# EAGLE design BoB Brain v05 (EAGLE 7.5.0)

## Sheet 1 of 2: LED Controller
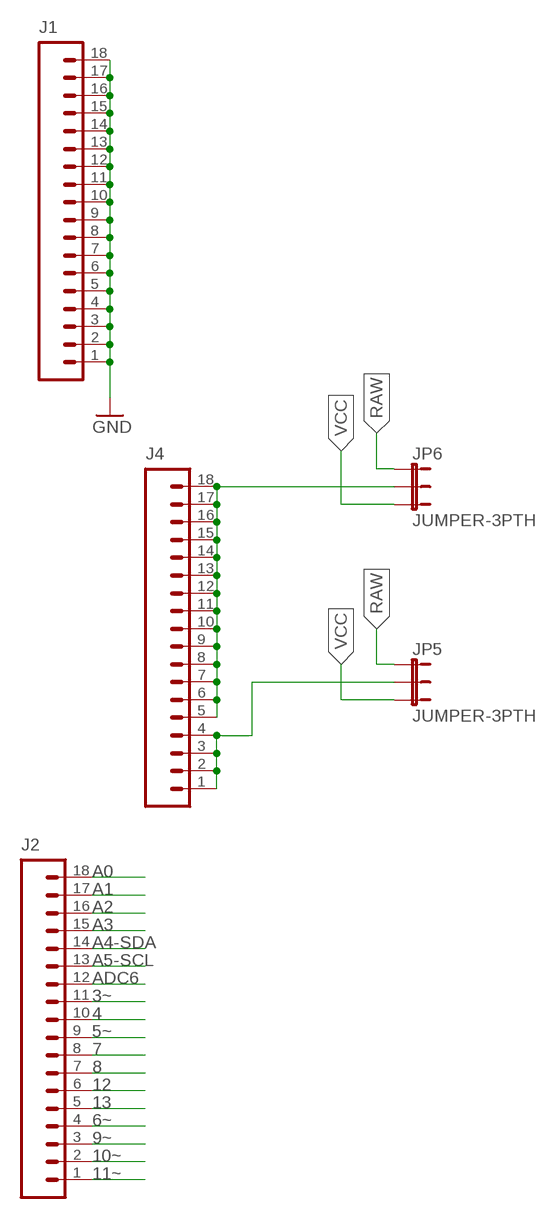
[diagram p0: schematic, sheet 1]

### Parts
J1  M18_  [1X18]
J2  M18_  [1X18]
J4  M18_  [1X18]
JP5  JUMPER-3PTH  [1X03]
JP6  JUMPER-3PTH  [1X03]

### Nets
3~: J2.18 ; also sheet 2
4: J2.17 ; also sheet 2
5~: J2.9 ; also sheet 2
6V: J4.5 J4.6 J4.7 J4.8 J4.9 J4.10 J4.11 J4.12 J4.13 J4.14 J4.15 J4.16 J4.17 J4.18 JP6.2
6~: J2.4 ; also sheet 2
7: J2.8 ; also sheet 2
8: J2.7 ; also sheet 2
9~: J2.3 ; also sheet 2
10~: J2.2 ; also sheet 2
11~: J2.1 ; also sheet 2
12: J2.6 ; also sheet 2
13: J2.5 ; also sheet 2
A0: J2.12 ; also sheet 2
A1: J2.10 ; also sheet 2
A2: J2.16 ; also sheet 2
A3: J2.13 ; also sheet 2
A4-SDA: J2.14 ; also sheet 2
A5-SCL: J2.15 ; also sheet 2
ADC6: J2.11 ; also sheet 2
GND: J1.1 J1.2 J1.3 J1.4 J1.5 J1.6 J1.7 J1.8 J1.9 J1.10 J1.11 J1.12 J1.13 J1.14 J1.15 J1.16 J1.17 J1.18 ; also sheet 2
PIN_PWR: J4.1 J4.2 J4.3 J4.4 JP5.2
RAW: JP5.1 JP6.1 ; also sheet 2
VCC: JP5.3 JP6.3 ; also sheet 2

## Sheet 2 of 2: My Arduino
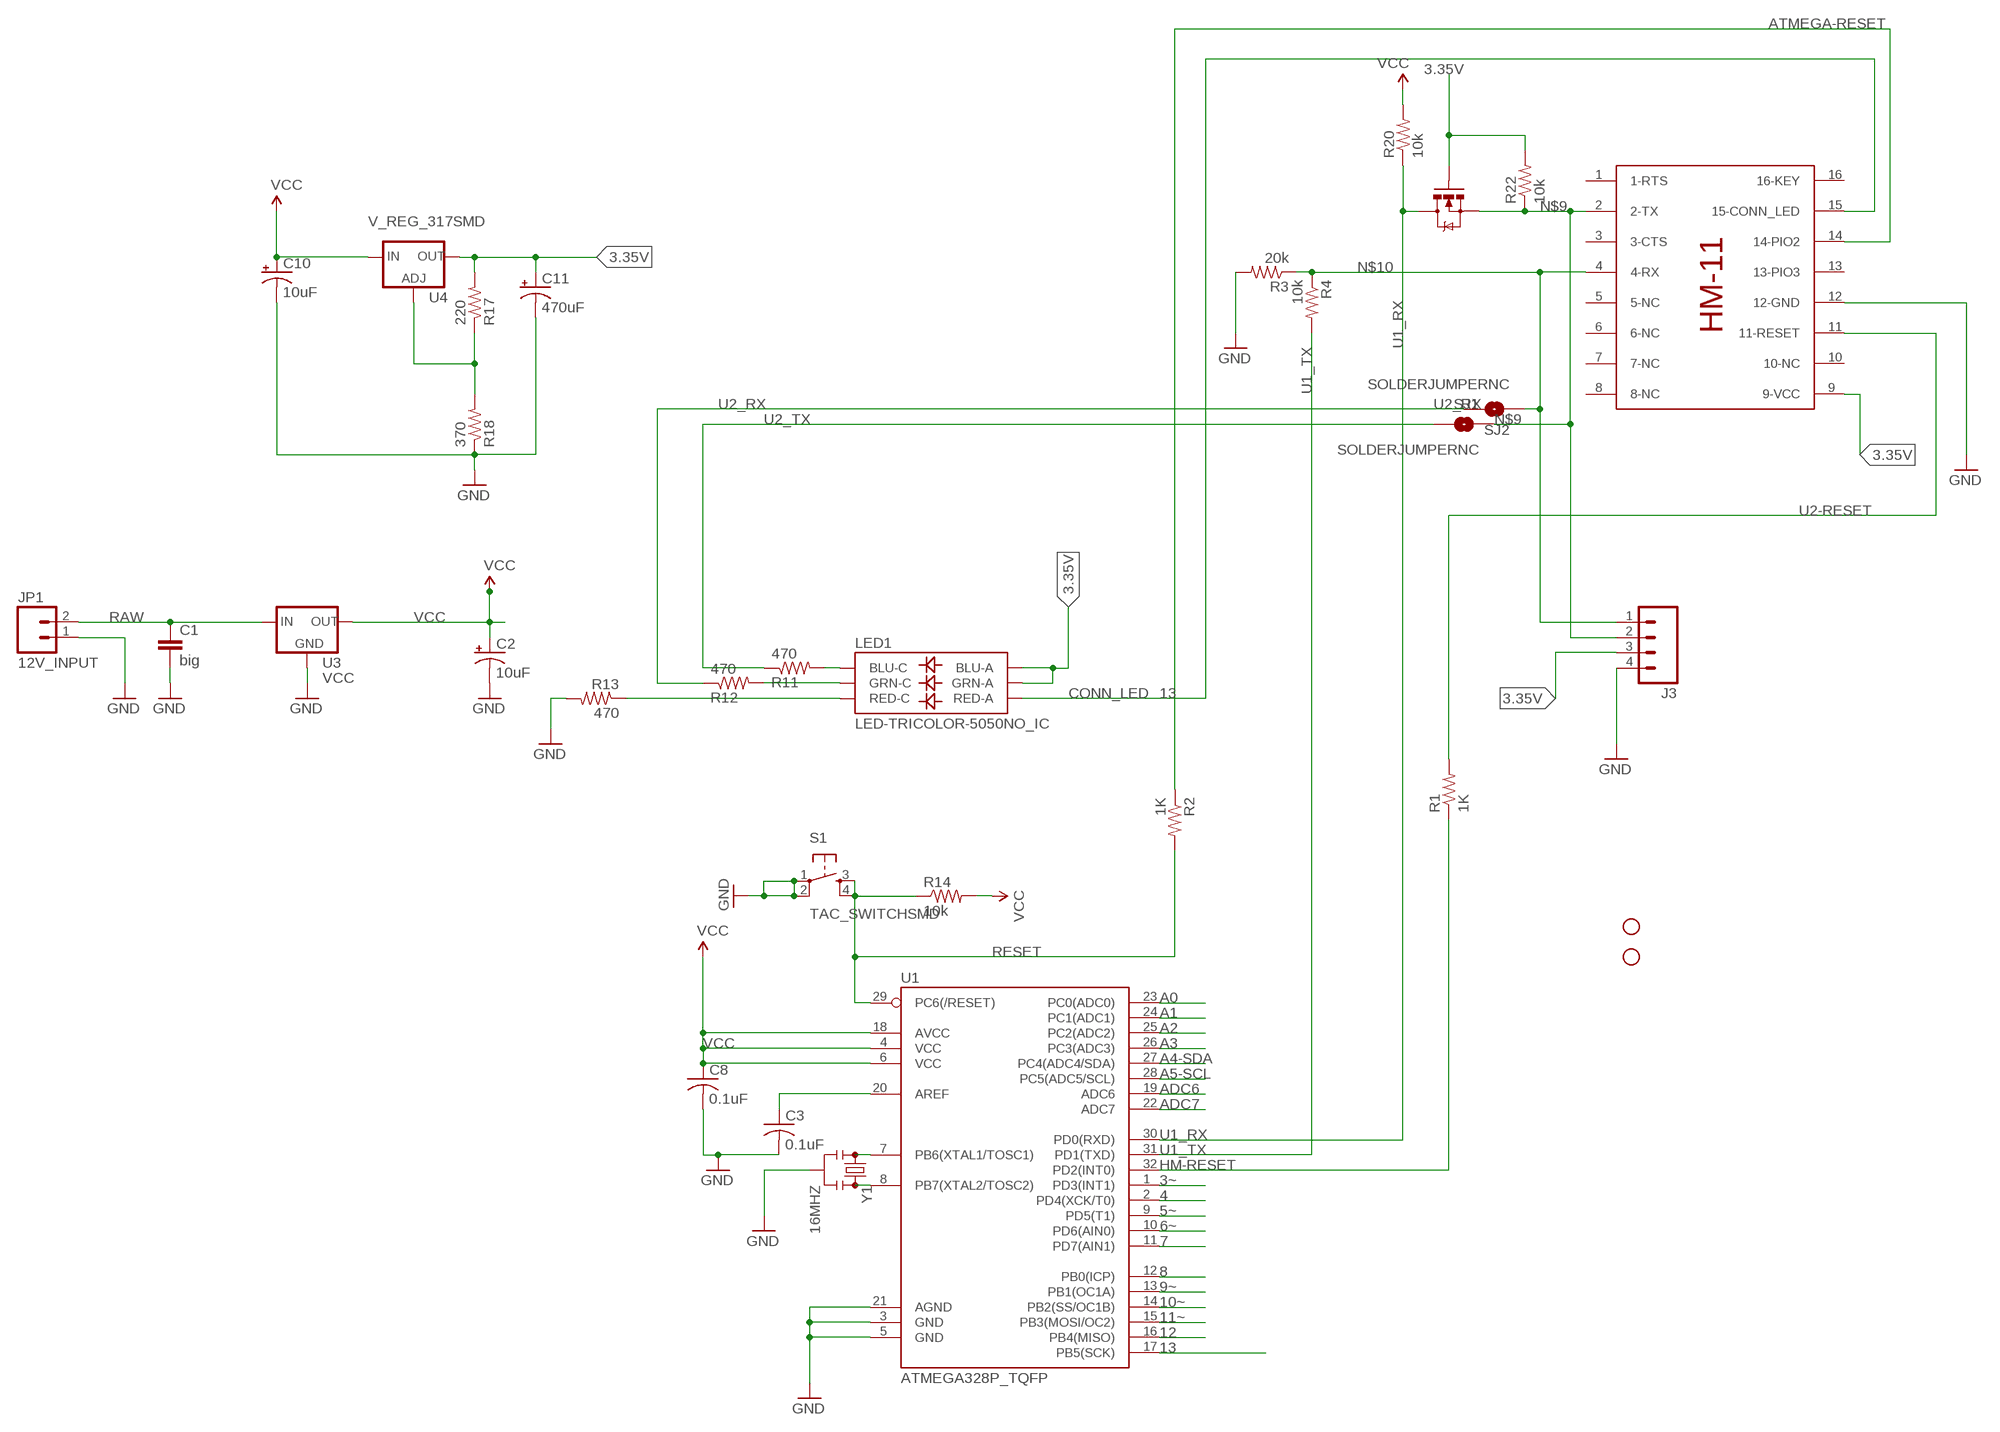
[diagram p1: schematic, sheet 2]

### Parts
C1  big  CAPPTH1  [CAP-PTH-5MM]
C2  10uF  CAP_POL3528  [EIA3528]
C3  0.1uF  C-USC0402  [C0402]
C8  0.1uF  C-USC0402  [C0402]
C10  10uF  CAP_POL3528  [EIA3528]
C11  470uF  CPOL-USCT3528  [CT3528]
H1  STAND-OFF  [STAND-OFF]
H2  STAND-OFF  [STAND-OFF]
J3  M04PTH  [1X04]
JP1  12V_INPUT  M025MM  [SCREWTERMINAL-5MM-2]
LED1  LED-TRICOLOR-5050NO_IC  [LED-TRICOLOR-5050]
Q1  MOSFET-NCHANNELAO3404A  [SOT23-3]
R1  1K  R-US_R0805W  [R0805W]
R2  1K  R-US_R0805W  [R0805W]
R3  20k  R-US_R0805W  [R0805W]
R4  10k  R-US_R0805W  [R0805W]
R11  470  R-US_R0805W  [R0805W]
R12  470  R-US_R0805W  [R0805W]
R13  470  R-US_R0805W  [R0805W]
R14  10k  R-US_R0805W  [R0805W]
R17  220  R-US_R0805W  [R0805W]
R18  370  R-US_R0805W  [R0805W]
R20  10k  R-US_R0805W  [R0805W]
R22  10k  R-US_R0805W  [R0805W]
S1  TAC_SWITCHSMD  [TACTILE-SWITCH-SMD]
SJ1  SOLDERJUMPERNC  [SJ_2S]
SJ2  SOLDERJUMPERNC  [SJ_2S]
U1  ATMEGA328P_TQFP  [TQFP32-08]
U3  VCC  V_REG_78XX7812  [TO-252]
U4  V_REG_317SMD  [SOT223]
U$1  HM-11  [HM-11]
Y1  16MHZ  RESONATOR16MHZ  [RESONATOR-SMD]

### Nets
3.35V: C11.-(+) J3.3 LED1.1(GRN-A) LED1.3(BLU-A) Q1.1(G) R17.2 R22.2 U4.2(OUT) U$1.9(9-VCC)
3~: U1.1(PD3(INT1)) ; also sheet 1
4: U1.2(PD4(XCK/T0)) ; also sheet 1
5~: U1.9(PD5(T1)) ; also sheet 1
6~: U1.10(PD6(AIN0)) ; also sheet 1
7: U1.11(PD7(AIN1)) ; also sheet 1
8: U1.12(PB0(ICP)) ; also sheet 1
9~: U1.13(PB1(OC1A)) ; also sheet 1
10~: U1.14(PB2(SS/OC1B)) ; also sheet 1
11~: U1.15(PB3(MOSI/OC2)) ; also sheet 1
12: U1.16(PB4(MISO)) ; also sheet 1
13: U1.17(PB5(SCK)) ; also sheet 1
A0: U1.23(PC0(ADC0)) ; also sheet 1
A1: U1.24(PC1(ADC1)) ; also sheet 1
A2: U1.25(PC2(ADC2)) ; also sheet 1
A3: U1.26(PC3(ADC3)) ; also sheet 1
A4-SDA: U1.27(PC4(ADC4/SDA)) ; also sheet 1
A5-SCL: U1.28(PC5(ADC5/SCL)) ; also sheet 1
ADC6: U1.19(ADC6) ; also sheet 1
ADC7: U1.22(ADC7)
AREF: C3.1 U1.20(AREF)
ATMEGA-RESET: R2.1 U$1.14(14-PIO2)
CONN_LED: LED1.2(RED-A) U$1.15(15-CONN_LED)
GND: C1.2 C2.C(-) C3.2 C8.2 C10.C(-) C11.+(-) J3.4 JP1.1 R3.2 R13.2 R18.1 S1.1 S1.2 U1.3(GND) U1.5(GND) U1.21(AGND) U3.3(GND) U$1.12(12-GND) Y1.2 ; also sheet 1
HM-RESET: R1.1 U1.32(PD2(INT0))
N$1: LED1.5(RED-C) R13.1
N$2: U1.7(PB6(XTAL1/TOSC1)) Y1.1
N$3: LED1.4(BLU-C) R11.2
N$4: LED1.6(GRN-C) R12.2
N$9: J3.2 Q1.2(S) R22.1 SJ1.1 U$1.2(2-TX)
N$10: J3.1 R3.1 R4.1 SJ2.1 U$1.4(4-RX)
N$11: U1.8(PB7(XTAL2/TOSC2)) Y1.3
N$14: R17.1 R18.2 U4.1(ADJ)
RAW: C1.1 JP1.2 U3.1(IN) ; also sheet 1
RESET: R2.2 R14.1 S1.3 S1.4 U1.29(PC6(/RESET))
U1_RX: Q1.3(D) R20.1 U1.30(PD0(RXD))
U1_TX: R4.2 U1.31(PD1(TXD))
U2-RESET: R1.2 U$1.11(11-RESET)
U2_RX: R12.1 SJ2.2
U2_TX: R11.1 SJ1.2
VCC: C2.A(+) C8.1 C10.A(+) R14.2 R20.2 U1.4(VCC) U1.6(VCC) U1.18(AVCC) U3.2(OUT) U4.3(IN) ; also sheet 1
Unconnected: U$1.1(1-RTS) U$1.3(3-CTS) U$1.5(5-NC) U$1.6(6-NC) U$1.7(7-NC) U$1.8(8-NC) U$1.10(10-NC) U$1.13(13-PIO3) U$1.16(16-KEY)

## Library data of the parts
C1 = SparkFun-Passives:CAP: Capacitor Standard 0603 ceramic capacitor, and 0.1" leaded capacitor.
C2 C10 = SparkFun-Capacitors:CAP_POL: Capacitor Polarized These are standard SMD and PTH capacitors. Normally 10uF, 47uF, and 100uF in electrolytic and tantalum varieties. Always verify the external diameter of the through hole cap, it varies with capacity, voltage, and manufacturer. The EIA devices should be standard.
C3 C8 = resistor:C-US: CAPACITOR, American symbol
C11 = resistor:CPOL-US: POLARIZED CAPACITOR, American symbol
H1 H2 = SparkFun-Electromechanical:STAND-OFF: #4 Stand Off This is the mechanical footprint for a #4 phillips button head screw. Use the keepout ring to avoid running the screw head into surrounding components. SKU : PRT-00447
J1 J2 J4 = SparkFun-Connectors:M18: 1x18 .1" header
J3 = SparkFun-Connectors:M04: Header 4 Standard 4-pin 0.1" header. Use with straight break away headers (SKU : PRT-00116), right angle break away headers (PRT-00553), swiss pins (PRT-00743), machine pins (PRT-00117), and female headers (PRT-00115). Molex polarized connector foot print use with SKU : PRT-08231 with associated crimp pins and housings. 1MM SMD Version SKU: PRT-10208; PROD_ID: CONN-09696
JP1 = SparkFun-Connectors:M02: Standard 2-pin 0.1" header. Use with - straight break away headers ( PRT-00116) - right angle break away headers (PRT-00553) - swiss pins (PRT-00743) - machine pins (PRT-00117) - female headers (PRT-00115) Molex polarized connector foot print use with: PRT-08233 with associated crimp pins and housings. 2.54_SCREWTERM for use with PRT-10571. 3.5mm Screw Terminal footprints for PRT-08084 5mm Screw Terminal footprints for use with PRT-08432; STOREFRONT_ID: PRT-08432
JP5 JP6 = SparkFun-Retired:JUMPER-3
LED1 = SparkFun-LED:LED-TRICOLOR-5050
Q1 = SparkFun-DiscreteSemi:MOSFET-NCHANNEL: Common NMOSFET Parts MFG P/N Store ID Prod ID FDD8780 TRANS-09984 SI7820DN TRANS-11055 FDS6630A IC-08089 2N7002PW TRANS-11151 FQP30N06L COM-10213 TRANS-10060 BSS123LT1G TRANS-08345 BSS138 TRANS-00830 BS170 2N7000; PROD_ID: TRAN-12988
R1-R4 R11-R14 R17 R18 R20 R22 = resistor:R-US_: RESISTOR, American symbol
S1 = SparkFun-Retired:TAC_SWITCH: Momentary Switch Button commonly used for reset or general input. Spark Fun Electronics SKU : COM-00097 SMT- SWCH-08247; PROD_ID: SWCH-08247
SJ1 SJ2 = SparkFun-Retired:SOLDERJUMPER: Solder Jumper Standard SMD solder jumper. Used to automate production. Two varients : Normally Open and Normally Closed are the same, but have different paste layers. NC will have a large amount of paste and should jumper during reflow.
U1 = SparkFun-DigitalIC:ATMEGA328P_TQFP; PROD_ID: IC-09069
U3 = SparkFun-PowerIC:V_REG_78XX: Voltage Regulator Standard 78xx regulator. IGO (Input Ground Output). Spark Fun Electronics SKU : COM-00107; PROD_ID: VREG-12370; VALUE: +12v
U4 = SparkFun-PowerIC:V_REG_317: Voltage Regulator Standard LM317 adjustable voltage regulator. AOI (Adjust Output Input). Google 'LM317 Calculator' for easy to use app to get the two resistor values needed. 240/720 for 5V output. 240/390 for 3.3V output. Spark Fun Electronics SKU : COM-00527
U$1 = HM-11-ladvien:HM-11
Y1 = SparkFun-FreqCtrl:RESONATOR: Resonator Small SMD resonator. Used, eg, on the Arduino Pro/ Pro Mini boards. 8MHz- XTAL-08895 16MHz- XTAL-08900; PROD_ID: XTAL-08900

## Board
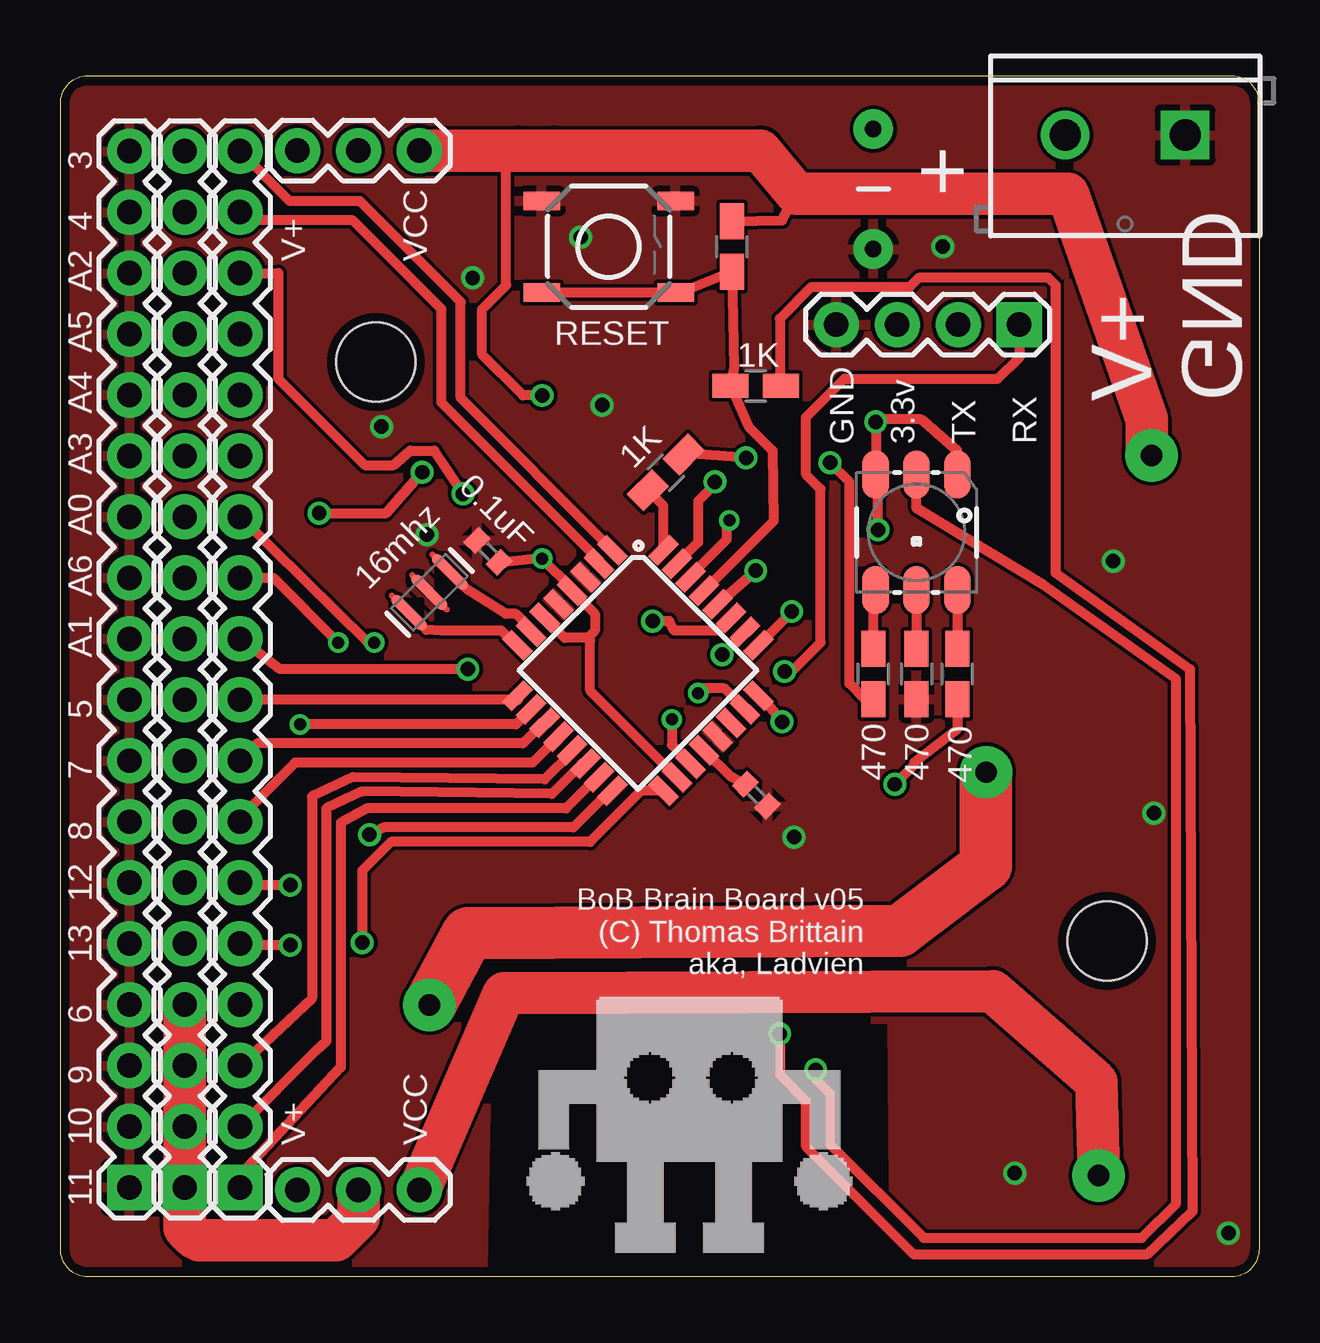
[diagram p2: board, top side]
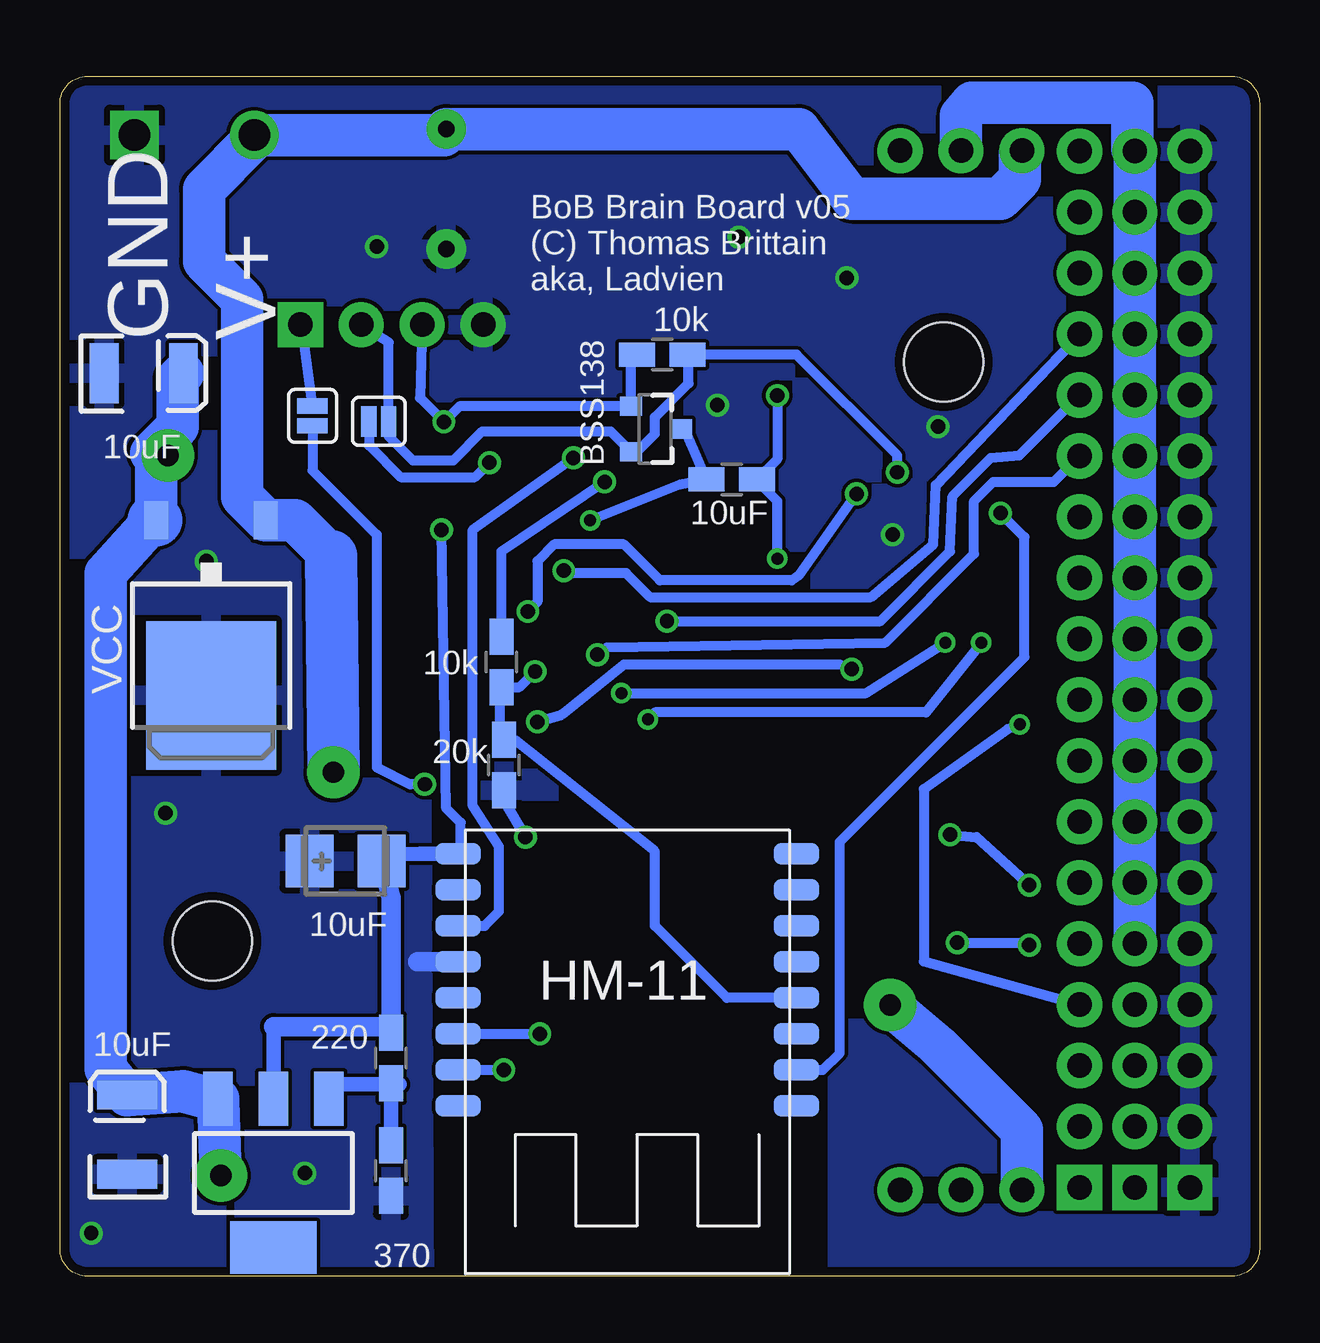
[diagram p3: board, bottom side, seen from below]

Size 50 x 50 mm. Coordinates in mm from the lower left corner, seen from the top.
Outline: 1.14,0 48.86,0 arc90 50,1.14 50,48.86 arc90 48.86,50 1.14,50 arc90 0,48.86 0,1.14 arc90 1.14,0
Copper layers (1*16): Top 0.0356mm / dielectric 1.5011mm / Bottom 0.0356mm
Design rules "LaenPCBOrder *": minimum track width 6mil, minimum drill 13mil, track to track 6mil, track to pad 6mil, pad to pad 6mil, via to via 6mil, smd to smd 6mil, copper to edge 15mil, drill to drill 6mil, minimum pad ring 7mil, minimum via ring 7mil, stop-mask expansion 3mil, vias tented up to drill 35mm, thermal gap 10mil

### Footprints (pad centres in the part's own frame; a part is rotated, then mirrored left to right if it is on the bottom)
CAP-PTH-5MM = drill 0.7 pad 1.651: 1 -2.5,0; 2 2.5,0
EIA3528 = smd 1.2 x 2.5: A 1.65,0; C -1.65,0
C0402 = smd 0.7 x 0.9: 1 -0.65,0; 2 0.65,0
CT3528 = smd 2 x 2.2: + -1.5,0; - 1.5,0
STAND-OFF = hole 3.302: 0,0
1X18 = drill 1.016 pad 1.88 square: 1 0,0 | drill 1.016 pad 1.88: 2 2.54,0; 3 5.08,0; 4 7.62,0; 5 10.16,0; 6 12.7,0; 7 15.24,0; 8 17.78,0; 9 20.32,0; 10 22.86,0; 11 25.4,0; 12 27.94,0; 13 30.48,0; 14 33.02,0; 15 35.56,0; 16 38.1,0; 17 40.64,0; 18 43.18,0
1X04 = drill 1.016 pad 1.88 square: 1 0,0 | drill 1.016 pad 1.88: 2 2.54,0; 3 5.08,0; 4 7.62,0
SCREWTERMINAL-5MM-2 = drill 1.3 pad 2.032 square: 1 0,0 | drill 1.3 pad 2.032: 2 5,0
1X03 = drill 1.016 pad 1.88: 1 0,0; 2 2.54,0; 3 5.08,0
LED-TRICOLOR-5050 = smd 2 x 1.1: 1 -2.4,1.7; 2 -2.4,0; 3 -2.4,-1.7; 4 2.4,-1.7; 5 2.4,0; 6 2.4,1.7
SOT23-3 = smd 0.8 x 0.9: 1 -0.95,-1; 2 0.95,-1; 3 0,1.1
R0805W = smd 1.5 x 1: 1 -1.052,0; 2 1.052,0
TACTILE-SWITCH-SMD = smd 1.524 x 0.762: 1 -2.794,1.905; 2 2.794,1.905; 3 -2.794,-1.905; 4 2.794,-1.905
SJ_2S = smd 0.635 x 1.27: 1 -0.412,0; 2 0.412,0
TQFP32-08 = smd 1.27 x 0.559: 1 -4.293,2.8; 2 -4.293,2; 3 -4.293,1.2; 4 -4.293,0.4; 5 -4.293,-0.4; 6 -4.293,-1.2; 7 -4.293,-2; 8 -4.293,-2.8; 17 4.293,-2.8; 18 4.293,-2; 19 4.293,-1.2; 20 4.293,-0.4; 21 4.293,0.4; 22 4.293,1.2; 23 4.293,2; 24 4.293,2.8 | smd 0.559 x 1.27: 9 -2.8,-4.293; 10 -2,-4.293; 11 -1.2,-4.293; 12 -0.4,-4.293; 13 0.4,-4.293; 14 1.2,-4.293; 15 2,-4.293; 16 2.8,-4.293; 25 2.8,4.293; 26 2,4.293; 27 1.2,4.293; 28 0.4,4.293; 29 -0.4,4.293; 30 -1.2,4.293; 31 -2,4.293; 32 -2.8,4.293
TO-252 = smd 1 x 1.6: 1 -2.28,-4.8; 2 2.28,-4.8 | smd 5.4 x 6.2: 3 0,2.5
SOT223 = smd 1.219 x 2.235: 1 -2.311,-3.099; 2 0,-3.099; 3 2.311,-3.099 | smd 3.6 x 2.2: 4 0,3.099
HM-11 = smd 1.9 x 0.9: 1 -0.3,11.5; 2 -0.3,10; 3 -0.3,8.5; 4 -0.3,7; 5 -0.3,5.5; 6 -0.3,4; 7 -0.3,2.5; 8 -0.3,1; 9 13.8,1; 10 13.8,2.5; 11 13.8,4; 12 13.8,5.5; 13 13.8,7; 14 13.8,8.5; 15 13.8,10; 16 13.8,11.5
RESONATOR-SMD = smd 0.45 x 1.905: 1 -1.2,0; 2 0,0; 3 1.2,0

### Placement (x,y rotation side)
C1  33.9,45.3 270 top
C2  46.51,37.64 0 bottom
C3  29.03,20.05 315 top
C8  17.84,30.2 135 top
C10  47.2,5.9 90 bottom
C11  38.1,17.3 0 bottom
H1  43.65,13.97 90 top
H2  13.17,38.1 90 top
J1  2.9,3.7 90 top
J2  7.5,3.7 90 top
J3  39.98,39.65 180 top
J4  5.2,3.7 90 top
JP1  46.9,47.55 180 top
JP5  9.9,3.6 0 top
JP6  9.9,46.9 0 top
LED1  35.7,31 270 top
Q1  25.2,35.3 270 bottom
R1  25.25,33.49 45 top
R2  29,37.1 180 top
R3  31.5,21.3 270 bottom
R4  31.6,25.6 90 bottom
R11  33.9,25.1 90 top
R12  37.4,25.1 90 top
R13  35.7,25.1 270 top
R14  28,42.9 90 top
R17  36.2,9.1 90 bottom
R18  36.2,4.4 90 bottom
R20  22,33.2 0 bottom
R22  24.9,38.4 180 bottom
S1  22.87,42.9 0 top
SJ1  36.71,35.62 180 bottom
SJ2  39.47,35.85 270 bottom
U1  24.09,25.24 315 top
U3  43.7,26.7 180 bottom
U4  41.1,4.3 180 bottom
U$1  19.6,18.6 180 bottom
Y1  15.4,28.5 225 top

### Tracks (layer width: path | path; a pad name or v marks a point on that pad's centre or on a via)
3.35V  (via drill 0.6)
  Top 0.406: v34.1,31.1 34.1,33.3 LED1.3 v34,35.6 34.1,35.7 35.9,35.7 37.4,34.4 LED1.1
  Bottom 0.406: R22.2 26.2,38.15 Q1.1 33.35,36.25 v34,35.6 35,36.6 J3.3 | 33.3,17.7 33.3,18.9 33.9,19.5 v34.1,31.1
  Bottom 0.61: U4.2 41.1,10.4 | C11.- 37.12,17.57 35,17.6 U$1.9 | U$1.9 33,17.6 32.9,17.7 33.3,17.7 U$1.9
  Bottom 0.813: 41.1,10.4 36.45,10.4 R17.2 36.2,15.77 C11.-
3~
  Top 0.406: U1.1 23.04,30.36 22.94,30.36 16.7,36.6 16.7,40.6 12.5,44.8 9.58,44.8 J2.18
4
  Top 0.406: U1.2 22.47,29.83 15.9,36.4 15.9,40.3 12.2,44 7.84,44 J2.17
5~
  Top 0.406: U1.9 19.08,24.02 J2.9
6V
  Bottom 1.778: JP6.2 12.44,48.36 12,48.9 5.3,48.9 5.3,46.98 J4.18 J4.17 J4.16 J4.15 J4.14 J4.13 J4.12 J4.11 J4.10 J4.9 J4.8 J4.7 J4.6 J4.5
6~  (via drill 0.5 pad 0.25)
  Top 0.406: U1.10 19.62,23.62 19,23 v10,23
  Bottom 0.406: v10,23 10.5,22.8 14,20.3 14,13.12 J2.4
7
  Top 0.406: U1.11 20.16,23.06 19.3,22.2 8.22,22.2 J2.8
8
  Top 0.406: U1.12 20.77,22.47 19.7,21.4 9.8,21.4 8,19.6 7.6,19.04 J2.7
9~
  Top 0.406: U1.13 21.34,21.84 20.2,20.7 12.2,20.8 10.5,20 10.5,11.58 J2.3
10~
  Top 0.406: U1.14 21.76,21.36 20.5,20.1 12.6,20.2 11.1,19.5 11.1,9.8 10.66,9.4 J2.2
11~
  Top 0.406: U1.15 22.39,20.79 21.1,19.5 12.8,19.5 11.7,18.9 11.7,8.7 7.5,4.2 J2.1
12  (via drill 0.6)
  Top 0.406: U1.16 22.93,20.23 21.4,18.7 13.5,18.7 v12.9,18.4 | v9.6,16.3 7.6,16.3 J2.6
  Bottom 0.406: v12.9,18.4 11.8,18.3 v9.6,16.3
13  (via drill 0.6)
  Top 0.406: U1.17 24.23,20.23 22.1,18.1 13.8,18.1 12.6,16.9 v12.6,13.9 | v9.6,13.8 7.56,13.8 J2.5
  Bottom 0.406: v12.6,13.9 9.9,13.9 v9.6,13.8
A0  (via drill 0.5 pad 0.25)
  Top 0.406: U1.23 28.54,23.66 27.7,24.5 26.8,24.5 v26.6,24.3 | v13.1,26.4 12.84,26.4 J2.12
  Bottom 0.406: v26.6,24.3 16.4,24.3 v13.1,26.4
A1  (via drill 0.6)
  Top 0.406: U1.24 29.51,23.81 v30.1,23.1 | v17,25.3 9.16,25.3 J2.10
  Bottom 0.406: v30.1,23.1 29.1,23.4 26.5,25.5 17.5,25.5 v17,25.3
A2  (via drill 0.6)
  Top 0.406: J2.16 9.1,41.8 9.1,37.4 12.7,33.8 13.9,33.8 14.6,34.4 15.6,34.4 v16.8,32.6 | v30.5,27.7 v30.5,27.69 U1.25
  Bottom 0.406: v16.8,32.6 19.2,29.2 19.5,29 25,29 26.5,30.5 29.4,30.5 30.1,29.8 30.1,28.1 v30.5,27.7
A3  (via drill 0.6)
  Top 0.406: U1.26 28.54,26.84 v27.6,25.9
  Bottom 0.406: v27.6,25.9 27.2,26.2 15.6,26.4 11.9,30.1 11.9,32.3 11.1,33.1 8.58,33.1 J2.13 7.92,34.18
A4-SDA  (via drill 0.6)
  Top 0.406: U1.27 27.45,26.9 25.6,26.9 25.4,27.3 v24.7,27.3
  Bottom 0.406: v24.7,27.3 15.8,27.3 12.9,30.2 12.8,32.5 11.2,34.1 10.02,34.2 J2.14
A5-SCL  (via drill 0.6)
  Top 0.406: U1.28 v29,29.4
  Bottom 0.406: v29,29.4 28.9,29.3 26.4,29.3 25.4,28.3 16.2,28.3 13.6,30.5 13.5,32.96 J2.15
ADC6  (via drill 0.5 pad 0.25)
  Top 0.406: J2.11 8.9,29.1 v11.6,26.4 | v25.5,23.2 25.5,22.14 U1.19
  Bottom 0.406: v11.6,26.4 13.9,23.5 25.2,23.5 v25.5,23.2
AREF
  Top 0.406: U1.20 27.95,20.82 C3.1
ATMEGA-RESET  (via drill 0.6)
  Top 0.406: v30,10.1 30,8.4 31.1,7.3 31.1,5.4 35.6,0.9 45.3,0.9 47.2,2.7 47.1,25.3 41.5,29.3 41.5,41.3 41.2,41.6 35.8,41.6 35.4,41.2 31.3,41.2 30,39.9 30,37.15 R2.1
  Bottom 0.406: U$1.14 v30,10.1
CONN_LED  (via drill 0.6)
  Top 0.406: v31.5,8.6 31.5,8.2 32.1,7.6 32.1,5.5 36,1.6 45.1,1.6 46.5,3 46.5,24.9 41,28.8 35.7,32 LED1.2
  Bottom 0.406: U$1.15 v31.5,8.6
GND  (via drill 0.6)
  Bottom 0.406: R3.2 31.5,19.8 v30.6,18.3
  Bottom 0.813: U$1.12 35.1,13.1
  other vias: 13.4,35.4 17.2,41.6 15.3,30.9 22.6,36.3 45.6,19.3 48.7,1.8 39.8,4.3 43.9,29.8 36.8,42.9 21.7,43.3
  pour Bottom: -1,-1 -1,51 52,51 52,-1 34.8,-1 34.9,20.2 17.6,20.2 17.6,-0.8 17.9,-0.8
  pour Top: -1,-1 -1,51 52,51 52,-1 34.8,-1 34.7,10.7 29.4,10.6 17.8,10.2 17.6,-0.8 17.9,-0.8
HM-RESET
  Top 0.406: U1.32 25.15,32.11 R1.1
N$1
  Top 0.406: LED1.5 R13.1
N$2
  Top 0.406: U1.7 19.64,26.96 19,27.6 18.59,27.6 16.96,28.63
N$3
  Top 0.406: R11.2 33.9,28.5 LED1.4
N$4
  Top 0.406: LED1.6 R12.2
N$9  (via drill 0.6)
  Top 0.406: v10.8,31.8 13.6,31.8 v15.1,33.5
  Bottom 0.406: U$1.2 18.2,8.6 17.5,9.3 17.5,18.1 9.8,25.8 9.8,30.8 v10.8,31.8 | v15.1,33.5 15.1,34.2 19.3,38.4 R22.1 23.8,38.35 23.8,37.2 25.2,35.8 25.2,35.1 25.95,34.35 Q1.2 27.05,35.2 32.4,35.2 33.6,34 35.3,34 36.3,35 SJ1.1 36.3,38.91 J3.2
N$10  (via drill 0.6 pad 0.25)
  Top 0.406: v30.2,25.2 30.5,25.2 31.7,26.4 31.7,32.8 31.1,33.4 31.1,35.8 32.7,37.4 39.1,37.4 40,38.3 40,39.63 J3.1
  Bottom 0.406: SJ2.1 39.96,40.03 J3.1 | U$1.4 22.2,11.6 25.2,14.6 25.2,17.7 31.05,22.35 R3.1 31.65,22.8 31.65,24.5 R4.1 30.85,24.55 v30.2,25.2
N$11
  Top 0.406: U1.8 19,26.3 18.4,26.9 15.9,26.9 15.27,26.93
N$14
  Bottom 0.61: U4.1 38.7,8 37.1,8 35.85,8 R17.1 R18.2
PIN_PWR
  Top 1.778: JP5.2 12.44,2.44 11.5,1.5 5.8,1.5 5.7,1.6 5.6,1.6 5.2,2 J4.1 J4.2 J4.3 J4.4
RAW  (via drill 0.89 pad 2.18, 0.9 pad 2.18)
  Top 2.184: v38.6,21 38.6,17.1 35,14.4 17,14.3 v15.4,11.3
  Bottom 1.778: JP6.1 10,46.8 10,45.7 10.8,44.9 17,44.9 19.2,47.8 C1.1 34,47.55 JP1.2 41.9,47.4 44,45.3 44,42.3 42.4,40.7 42.4,32.48 U3.1 40.2,31.5 38.7,30 | v15.4,11.3 13.4,9.6 9.9,6.1 JP5.1
  Bottom 2.184: 38.7,30 v38.6,21
RESET
  Top 0.406: U1.29 29.75,31.46 29.7,34.4 28.7,35.4 R2.2 28.1,37.85 R14.1 26.01,41.05 S1.4 S1.3
U1_RX  (via drill 0.5 pad 0.25)
  Top 0.406: U1.30 26.28,29.18 27.8,30.7 27.8,31.4 v27.9,31.5
  Bottom 0.406: Q1.3 23.85,35.05 R20.1 24.15,33 v27.9,31.5
U1_TX  (via drill 0.6)
  Top 0.406: v27.3,33.1 27.3,33 26.6,32.3 26.6,30.58 U1.31
  Bottom 0.406: R4.2 31.6,30.2 v27.3,33.1
U2-RESET  (via drill 0.6)
  Top 0.406: v28.6,34.1 26.05,34.3 R1.2
  Bottom 0.406: U$1.11 32.3,14.6 31.7,15.2 31.7,17.9 32.8,19.6 32.8,31.1 v28.6,34.1
U2_RX  (via drill 0.6 pad 0.25)
  Top 0.406: R12.1 37.4,22.8 35.6,21.4 35.6,21.3 v34.8,20.5
  Bottom 0.406: SJ2.2 39.47,33.57 36.8,30.9 36.8,21.2 35.4,20.5 v34.8,20.5
U2_TX  (via drill 0.6)
  Top 0.406: R11.1 33.55,24.05 32.9,24.7 32.9,33.1 v32.1,33.9
  Bottom 0.406: 32,33.9 v32.1,33.9 32.7,33.3 35.8,33.3 37.12,34.62 SJ1.2
VCC  (via drill 0.5 pad 0.25, 0.6, 0.89 pad 2.18, 0.9 pad 2.18)
  Top 0.406: 22,26.6 22.3,26.9 22.3,27.6 U1.4 21.34,28.66 v20.1,29.9 20.06,29.94 C8.1 | 22,26.6 21.04,26.6 U1.6 | 22,26.6 22.1,26.5 22.1,24.4 U1.18 25.71,20.75 25.75,20.75 | 20.1,46.4 20.6,46.9 | 16.85,8.4 16.98,8.26 | R14.2 30.1,44 30.7,45.1 | v20.1,36.7 19.3,36.7 17.6,38.4 17.6,40.3 18.6,41.3 18.6,46.4 19.1,46.9
  Top 1.778: JP6.3 19.1,46.9 20.6,46.9 29.2,46.9 30.7,45.1 42,45.1 45.3,35.7 45.3,34.4 v45.5,34.2 | JP5.3 16.98,8.26 18.5,11.79 38.88,11.88 43.2,8.1 v43.3,4.2
  Bottom 0.406: 21,32.95 R20.2 | v20.1,29.9 20.1,32.3 21.1,33.3 R20.2 | v20.1,36.7 20.1,34.05 R20.2
  Bottom 1.778: v43.3,4.2 43.4,7.31 | 43.4,7.31 U4.3 | 43.4,7.31 44.86,7.71 C10.A 48.1,8.65 48.1,29.3 46.1,31.5 | C2.A 45.1,37.39 45.1,35.4 46.2,34.3 v45.5,34.2 45.98,33.72 U3.2
  Bottom 2.184: U3.2 46.1,31.5

### Text on the board
tNames: 3 | + | 4 | V+ | VCC | A2 | RESET | A5 | 1K | V+ | GND | A4 | 1K | GND | 3.3v | TX | RX | A3 | 0.1uF | A0 | A6 | 16mhz | A1 | 5 | 470 | 470 | 470 | 7 | 8 | 12 | BoB Brain Board v05 / (C) Thomas Brittain / aka, Ladvien | 13 | 6 | 9 | 10 | V+ | VCC | 11
bNames: 10k | BoB Brain Board v05 / (C) Thomas Brittain / aka, Ladvien | V+ | GND | 10uF | BSS138 | 10uF | 10k | 20k | 10uF | 220 | 10uF | 370